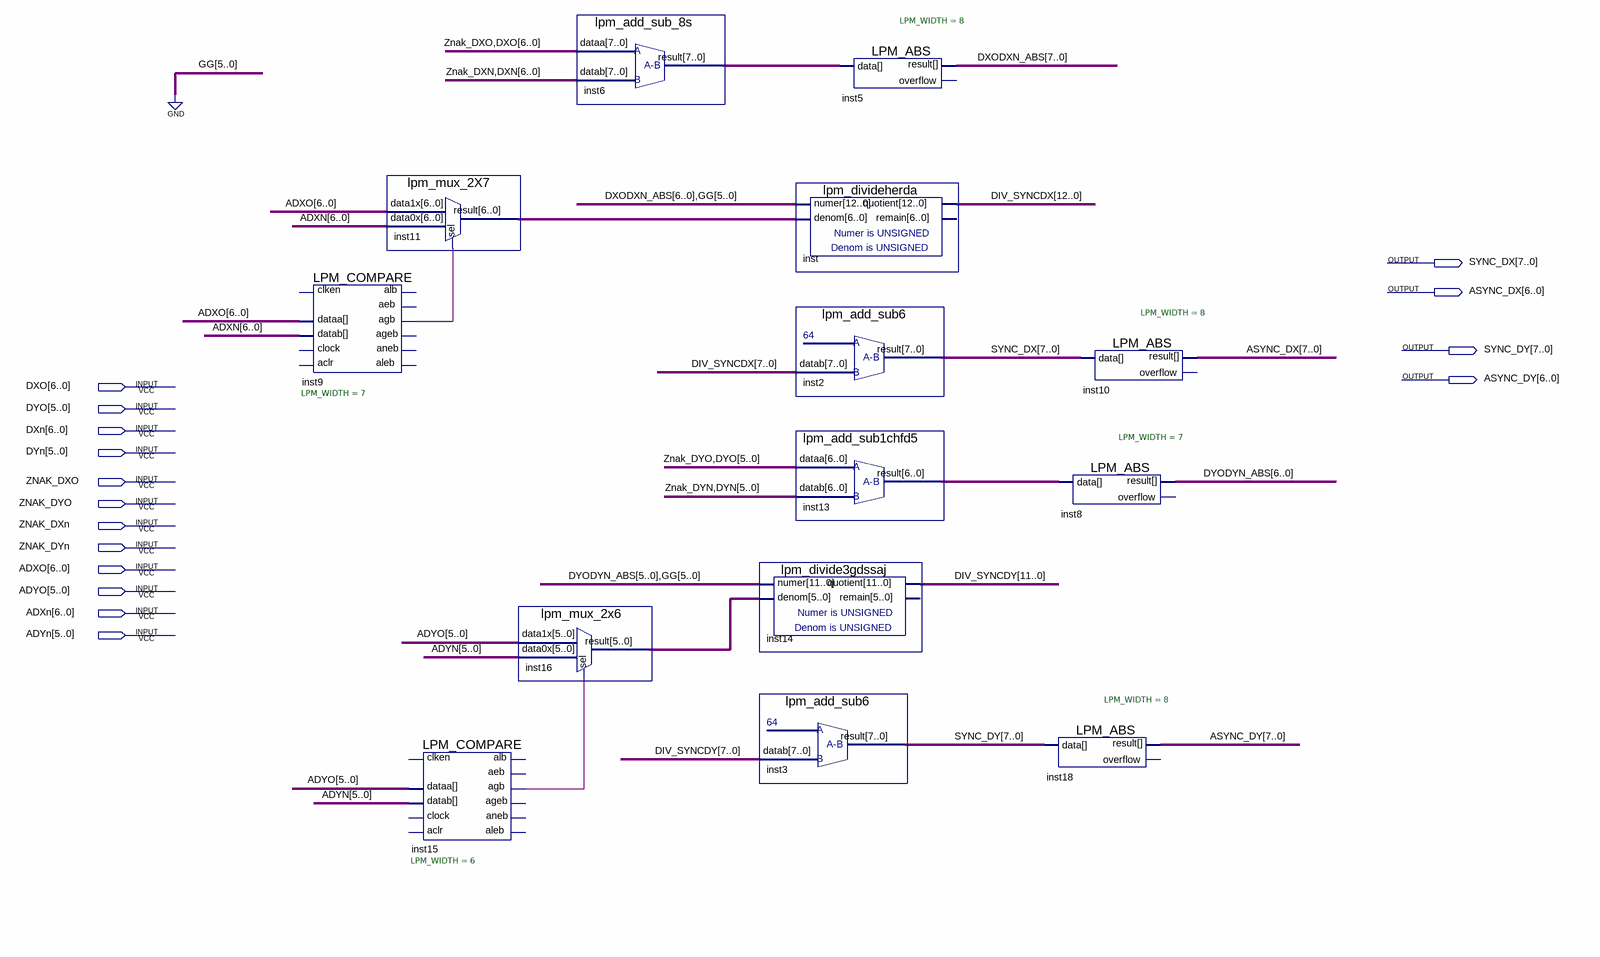
[diagram p0: schematic sheet]
// Quartus schematic SYNC_dxdy_26.bdf as structural Verilog: 14 symbols, 16 pins
module SYNC_dxdy_26 (
  input  [6:0] DXO,
  input  [5:0] DYO,
  input  [6:0] DXn,
  input  [5:0] DYn,
  input  ZNAK_DXO,
  input  ZNAK_DYO,
  input  ZNAK_DXn,
  input  ZNAK_DYn,
  input  [6:0] ADXO,
  input  [5:0] ADYO,
  input  [6:0] ADXn,
  input  [5:0] ADYn,
  output [7:0] SYNC_DX,
  output [7:0] ASYNC_DX,
  output [7:0] SYNC_DY,
  output [7:0] ASYNC_DY
);

  wire inst9_agb, inst15_agb;
  wire [5:0] inst16_result;
  wire [6:0] DYODYN_ABS, inst11_result, inst13_result;
  wire [7:0] DXODXN_ABS, inst6_result;
  wire [11:0] DIV_SYNCDY;
  wire [12:0] DIV_SYNCDX;

  LPM_COMPARE #(.LPM_WIDTH(7)) inst9 (
    .dataa(ADXO), .datab(ADXn), .agb(inst9_agb));  // open: clock, aclr, clken, aleb, aeb, aneb, ageb, alb
  lpm_mux_2X7 inst11 (.data1x(ADXO), .data0x(ADXn), .sel(inst9_agb), .result(inst11_result));
  LPM_COMPARE #(.LPM_WIDTH(6)) inst15 (
    .dataa(ADYO), .datab(ADYn), .agb(inst15_agb));  // open: clock, aclr, clken, aleb, aeb, aneb, ageb, alb
  lpm_mux_2x6 inst16 (.data1x(ADYO), .data0x(ADYn), .sel(inst15_agb), .result(inst16_result));
  lpm_add_sub_8s inst6 (.dataa({ZNAK_DXO, DXO}), .datab({ZNAK_DXn, DXn}), .result(inst6_result));
  lpm_divide3gdssaj inst14 (
    .numer({DYODYN_ABS[5:0], {6{1'b0}}}), .denom(inst16_result), .quotient(DIV_SYNCDY));  // open: remain
  lpm_add_sub6 inst3 (.datab(DIV_SYNCDY[7:0]), .result(SYNC_DY));
  LPM_ABS #(.LPM_WIDTH(8)) inst5 (.data(inst6_result), .result(DXODXN_ABS));  // open: overflow
  lpm_divideherda inst (
    .numer({DXODXN_ABS[6:0], {6{1'b0}}}), .denom(inst11_result), .quotient(DIV_SYNCDX));  // open: remain
  lpm_add_sub6 inst2 (.datab(DIV_SYNCDX[7:0]), .result(SYNC_DX));
  lpm_add_sub1chfd5 inst13 (.dataa({ZNAK_DYO, DYO}), .datab({ZNAK_DYn, DYn}), .result(inst13_result));
  LPM_ABS #(.LPM_WIDTH(8)) inst10 (.data(SYNC_DX), .result(ASYNC_DX));  // open: overflow
  LPM_ABS #(.LPM_WIDTH(7)) inst8 (.data(inst13_result), .result(DYODYN_ABS));  // open: overflow
  LPM_ABS #(.LPM_WIDTH(8)) inst18 (.data(SYNC_DY), .result(ASYNC_DY));  // open: overflow
endmodule
